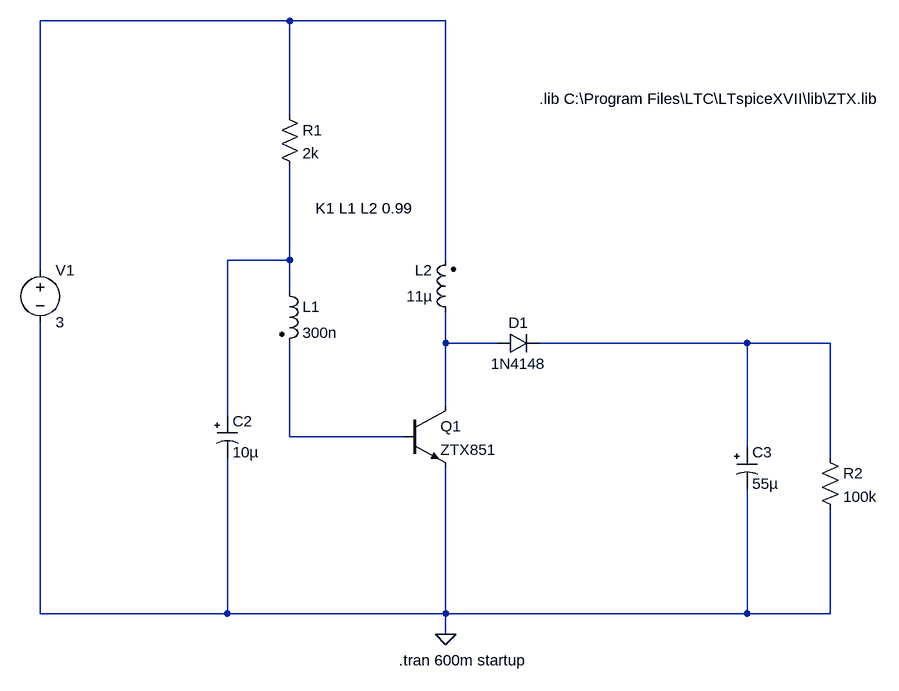
[diagram p0: schematic kursach 2 (5).asc]
kursach 2 (5).asc, the LTspice schematic file:
Version 4
SHEET 1 2132 680
WIRE 560 -2816 176 -2816
WIRE 800 -2816 560 -2816
WIRE 560 -2672 560 -2816
WIRE 560 -2448 560 -2592
WIRE 560 -2448 464 -2448
WIRE 800 -2448 800 -2816
WIRE 176 -2432 176 -2816
WIRE 560 -2400 560 -2448
WIRE 800 -2320 800 -2368
WIRE 880 -2320 800 -2320
WIRE 1264 -2320 944 -2320
WIRE 1392 -2320 1264 -2320
WIRE 800 -2224 800 -2320
WIRE 464 -2208 464 -2448
WIRE 560 -2176 560 -2320
WIRE 736 -2176 560 -2176
WIRE 1264 -2160 1264 -2320
WIRE 1392 -2144 1392 -2320
WIRE 176 -1904 176 -2352
WIRE 464 -1904 464 -2144
WIRE 464 -1904 176 -1904
WIRE 800 -1904 800 -2128
WIRE 800 -1904 464 -1904
WIRE 1264 -1904 1264 -2096
WIRE 1264 -1904 800 -1904
WIRE 1392 -1904 1392 -2064
WIRE 1392 -1904 1264 -1904
WIRE 800 -1872 800 -1904
FLAG 800 -1872 0
SYMBOL npn 736 -2224 R0
SYMATTR InstName Q1
SYMATTR Value ZTX851
SYMBOL polcap 448 -2208 R0
WINDOW 3 24 56 Left 2
SYMATTR Value 10µ
SYMATTR InstName C2
SYMATTR Description Capacitor
SYMATTR Type cap
SYMATTR SpiceLine V=6.3 Irms=2.21565 Rser=0.055 Lser=0 mfg="KEMET" pn="A700V106M006ATE055" type="Al electrolytic"
SYMBOL res 544 -2688 R0
SYMATTR InstName R1
SYMATTR Value 2k
SYMBOL ind2 544 -2416 R0
SYMATTR InstName L1
SYMATTR Value 300n
SYMATTR Type ind
SYMBOL ind2 816 -2352 R180
WINDOW 0 36 80 Left 2
WINDOW 3 36 40 Left 2
SYMATTR InstName L2
SYMATTR Value 11µ
SYMATTR Type ind
SYMBOL polcap 1248 -2160 R0
WINDOW 3 24 56 Left 2
SYMATTR Value 55µ
SYMATTR InstName C3
SYMATTR Description Capacitor
SYMATTR Type cap
SYMATTR SpiceLine V=2 Irms=3 Rser=0.011 Lser=0
SYMBOL diode 880 -2304 R270
WINDOW 0 32 32 VTop 2
WINDOW 3 0 32 VBottom 2
SYMATTR InstName D1
SYMATTR Value 1N4148
SYMBOL voltage 176 -2448 R0
WINDOW 123 0 0 Left 0
WINDOW 39 0 0 Left 0
SYMATTR InstName V1
SYMATTR Value 3
SYMBOL res 1376 -2160 R0
SYMATTR InstName R2
SYMATTR Value 100k
TEXT 600 -2528 Left 2 !K1 L1 L2 0.99
TEXT 728 -1832 Left 2 !.tran 600m startup
TEXT 944 -2696 Left 2 !.lib C:\\Program Files\\LTC\\LTspiceXVII\\lib\\ZTX.lib

The netlist it stands for:
* kursach 2 (5).asc
Q1 N003 N005 0 0 ZTX851
C2 N002 0 10µ V=6.3 Irms=2.21565 Rser=0.055 Lser=0 mfg="KEMET" pn="A700V106M006ATE055" type="Al electrolytic"
R1 N001 N002 2k
L1 N002 N005 300n
L2 N003 N001 11µ
C3 N004 0 55µ V=2 Irms=3 Rser=0.011 Lser=0
D1 N003 N004 1N4148
V1 N001 0 3
R2 N004 0 100k
.model D D
.lib standard.dio
.model NPN NPN
.model PNP PNP
.lib standard.bjt
K1 L1 L2 0.99
.tran 600m startup
.lib C:\Program Files\LTC\LTspiceXVII\lib\ZTX.lib
.backanno
.end